# EAGLE design LayerOne_2011_bkt_switches (EAGLE 5.11)
OC_NEWARK: unknown
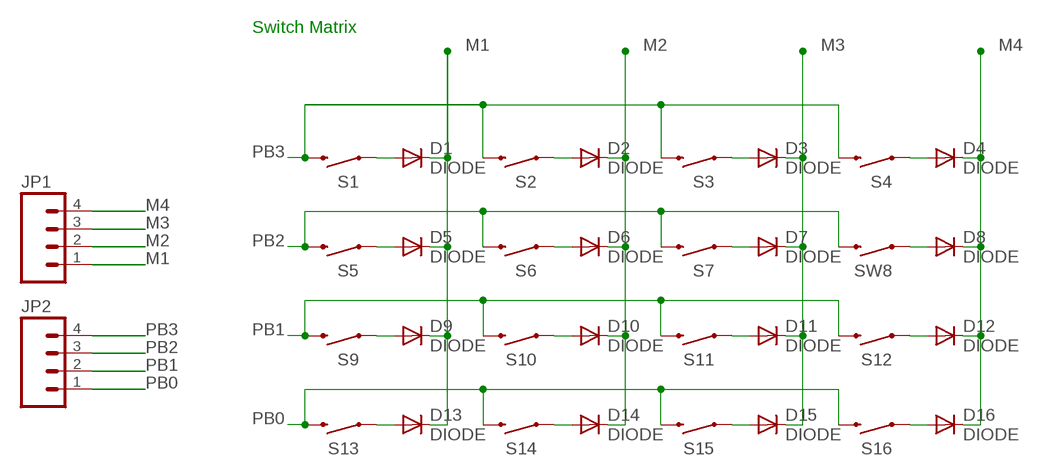
[diagram p0: schematic, sheet 1]

## Parts
D1  DIODE  DIODE1N4148  [DIODE-1N4148]
D2  DIODE  DIODE1N4148  [DIODE-1N4148]
D3  DIODE  DIODE1N4148  [DIODE-1N4148]
D4  DIODE  DIODE1N4148  [DIODE-1N4148]
D5  DIODE  DIODE1N4148  [DIODE-1N4148]
D6  DIODE  DIODE1N4148  [DIODE-1N4148]
D7  DIODE  DIODE1N4148  [DIODE-1N4148]
D8  DIODE  DIODE1N4148  [DIODE-1N4148]
D9  DIODE  DIODE1N4148  [DIODE-1N4148]
D10  DIODE  DIODE1N4148  [DIODE-1N4148]
D11  DIODE  DIODE1N4148  [DIODE-1N4148]
D12  DIODE  DIODE1N4148  [DIODE-1N4148]
D13  DIODE  DIODE1N4148  [DIODE-1N4148]
D14  DIODE  DIODE1N4148  [DIODE-1N4148]
D15  DIODE  DIODE1N4148  [DIODE-1N4148]
D16  DIODE  DIODE1N4148  [DIODE-1N4148]
JP1  M04PTH  [1X04]
JP2  M04PTH  [1X04]
S1  SWITCH-MOMENTARY-2PTH  [TACTILE-PTH]
S2  SWITCH-MOMENTARY-2PTH  [TACTILE-PTH]
S3  SWITCH-MOMENTARY-2PTH  [TACTILE-PTH]
S4  SWITCH-MOMENTARY-2PTH  [TACTILE-PTH]
S5  SWITCH-MOMENTARY-2PTH  [TACTILE-PTH]
S6  SWITCH-MOMENTARY-2PTH  [TACTILE-PTH]
S7  SWITCH-MOMENTARY-2PTH  [TACTILE-PTH]
S9  SWITCH-MOMENTARY-2PTH  [TACTILE-PTH]
S10  SWITCH-MOMENTARY-2PTH  [TACTILE-PTH]
S11  SWITCH-MOMENTARY-2PTH  [TACTILE-PTH]
S12  SWITCH-MOMENTARY-2PTH  [TACTILE-PTH]
S13  SWITCH-MOMENTARY-2PTH  [TACTILE-PTH]
S14  SWITCH-MOMENTARY-2PTH  [TACTILE-PTH]
S15  SWITCH-MOMENTARY-2PTH  [TACTILE-PTH]
S16  SWITCH-MOMENTARY-2PTH  [TACTILE-PTH]
SW8  SWITCH-MOMENTARY-2PTH  [TACTILE-PTH]

## Nets
M1: D1.C D5.C D9.C D13.C JP1.1
M2: D2.C D6.C D10.C D14.C JP1.2
M3: D3.C D7.C D11.C D15.C JP1.3
M4: D4.C D8.C D12.C D16.C JP1.4
N$13: D1.A S1.1
N$16: D2.A S2.1
N$17: D3.A S3.1
N$18: D4.A S4.1
N$19: D5.A S5.1
N$20: D6.A S6.1
N$21: D7.A S7.1
N$22: D8.A SW8.1
N$23: D9.A S9.1
N$24: D10.A S10.1
N$25: D11.A S11.1
N$26: D12.A S12.1
N$33: D13.A S13.1
N$34: D14.A S14.1
N$35: D15.A S15.1
N$36: D16.A S16.1
PB0: JP2.1 S13.3 S14.3 S15.3 S16.3
PB1: JP2.2 S9.3 S10.3 S11.3 S12.3
PB2: JP2.3 S5.3 S6.3 S7.3 SW8.3
PB3: JP2.4 S1.3 S2.3 S3.3 S4.3

## Notes on the sheet
- Switch Matrix

## Library data of the parts
D1-D16 = SparkFun:DIODE: Diode These are standard reverse protection diodes and small signal diodes. SMA package can handle up to about 1A. SOD-323 can handle about 200mA. What the SOD-323 package when ordering, there are some mfgs out there that are 5-pin packages.
JP1 JP2 = SparkFun:M04: Header 4 Standard 4-pin 0.1" header. Use with straight break away headers (SKU : PRT-00116), right angle break away headers (PRT-00553), swiss pins (PRT-00743), machine pins (PRT-00117), and female headers (PRT-00115). Molex polarized connector foot print use with SKU : PRT-08231 with associated crimp pins and housings. 1MM SMD Version SKU: PRT-10208
S1-S7 S9-S16 SW8 = LayerOne_2011:SWITCH-MOMENTARY-2

## Net classes
0 default: width 0.406 mm
1 LED: width 0.305 mm

## Board
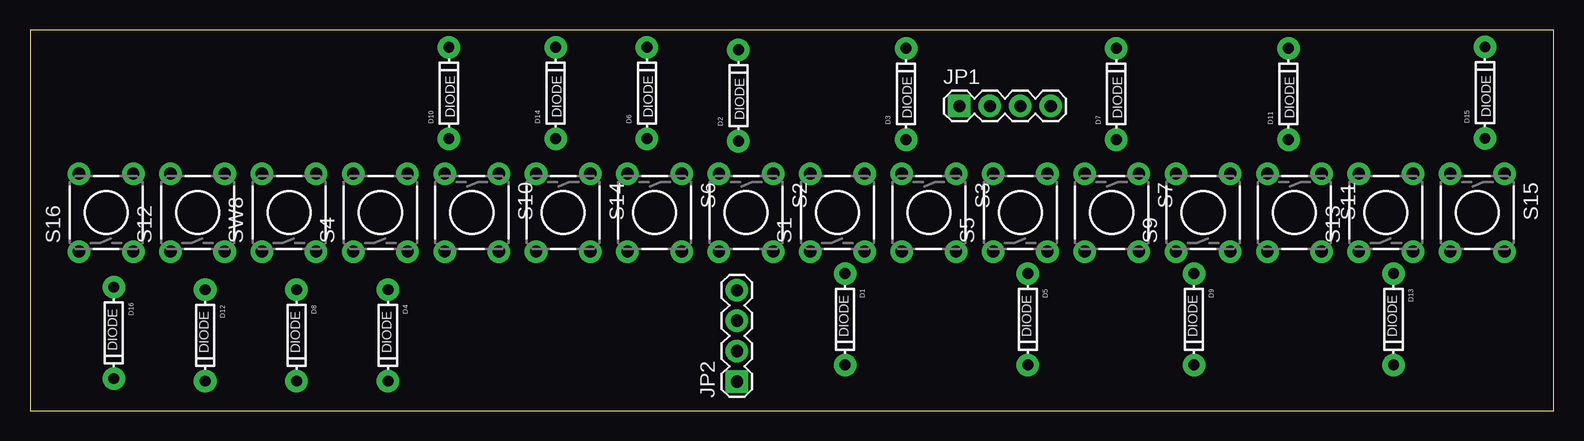
[diagram p1: board, top side]
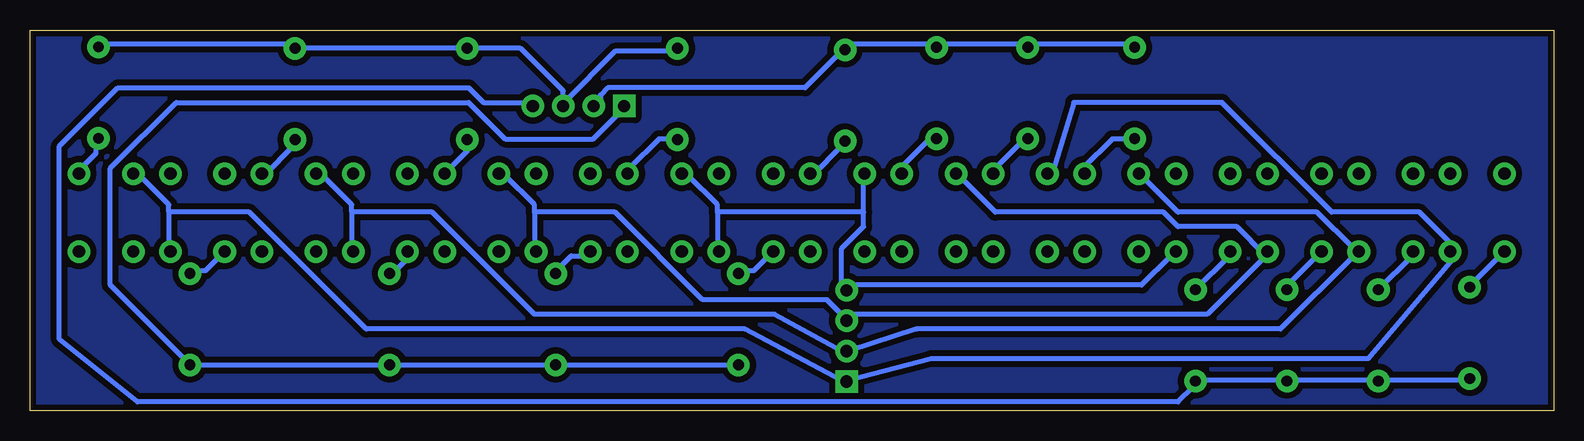
[diagram p2: board, bottom side, seen from below]

Size 127 x 31.75 mm. Coordinates in mm from the lower left corner, seen from the top.
Outline: 127,0 127,31.75 0,31.75 0,0 127,0
Copper layers (1*16): Top 0.0356mm / dielectric 1.5011mm / Bottom 0.0356mm
Design rules "SparkFun-mod *": minimum track width 8mil, minimum drill 32mil, track to track 14mil, track to pad 14mil, pad to pad 12mil, via to via 12mil, smd to smd 8mil, copper to edge 12mil, drill to drill 8mil, minimum pad ring 14mil, minimum via ring 10mil, stop-mask expansion 4mil, vias tented up to drill 34mil, thermal gap 10mil
Milling: 4 lines

### Footprints (pad centres in the part's own frame; a part is rotated, then mirrored left to right if it is on the bottom)
DIODE-1N4148 = drill 0.9 pad 1.88 round: A -3.81,0; C 3.81,0
1X04 = drill 1.016 pad 1.88 square: 1 0,0 | drill 1.016 pad 1.88 round: 2 2.54,0; 3 5.08,0; 4 7.62,0
TACTILE-PTH = drill 1.016 pad 1.88 round: 1 -3.251,2.261; 2 3.251,2.261; 3 -3.251,-2.261; 4 3.251,-2.261

### Placement (x,y rotation side)
D1  67.94,7.62 270 top
D2  59.05,26.29 90 top
D3  73.03,26.42 90 top
D4  29.84,6.27 270 top
D5  83.19,7.62 270 top
D6  51.44,26.49 90 top
D7  90.55,26.42 90 top
D8  22.23,6.27 270 top
D9  97.03,7.62 270 top
D10  34.92,26.49 90 top
D11  104.9,26.42 90 top
D12  14.61,6.27 270 top
D13  113.66,7.62 270 top
D14  43.81,26.49 90 top
D15  121.28,26.52 90 top
D16  6.98,6.48 270 top
JP1  77.47,25.4 0 top
JP2  58.93,2.41 90 top
S1  67.31,16.51 90 top
S2  59.69,16.51 270 top
S3  74.93,16.51 270 top
S4  29.21,16.51 90 top
S5  82.55,16.51 90 top
S6  52.07,16.51 270 top
S7  90.17,16.51 270 top
S9  97.79,16.51 90 top
S10  36.83,16.51 270 top
S11  105.41,16.51 270 top
S12  13.97,16.51 90 top
S13  113.03,16.51 90 top
S14  44.45,16.51 270 top
S15  120.65,16.51 270 top
S16  6.35,16.51 90 top
SW8  21.59,16.51 90 top

### Tracks (layer width: path | path; a pad name or v marks a point on that pad's centre or on a via)
M1
  Bottom 0.406: D1.C 68.48,3.76 83.11,3.76 D5.C 83.72,3.76 96.52,3.76 D9.C 97.13,3.76 113.59,3.76 D13.C 114.2,4.37 120.29,10.46 120.29,20.22 114.81,25.71 90.42,25.71 87.38,22.66 80.06,22.66 77.62,25.1 JP1.1
M2
  Bottom 0.406: D10.C 34.95,30.58 43.48,30.58 D14.C 44.09,30.58 51.41,30.58 D6.C 52.02,30.58 58.73,30.58 D2.C 59.33,29.97 62.38,26.92 78.84,26.92 79.45,26.31 79.45,25.71 JP1.2
M3
  Bottom 0.406: D3.C 73.35,29.97 78.23,29.97 82.5,25.71 JP1.3 82.55,26.67 86.11,30.23 D7.C 104.09,30.23 104.44,30.58 D11.C 105.05,30.58 120.9,30.58 D15.C
M4
  Bottom 0.406: D16.C 7.52,2.54 14.22,2.54 D12.C 14.83,2.54 22.15,2.54 D8.C 22.76,2.54 29.46,2.54 D4.C 30.07,1.93 31.29,0.71 118.06,0.71 124.56,5.94 124.56,22.05 119.69,26.92 90.42,26.92 89.21,25.71 85.55,25.71 JP1.4
N$1
  pour Bottom (isolate 0.508): 0,31.75 0,0 127,0 127,31.75
N$13
  Bottom 0.406: D1.A 67.87,11.68 66.65,11.68 65.43,12.9 S1.1
N$16
  Bottom 0.406: D2.A 59.33,22.05 61.77,19.61 S2.1
N$17
  Bottom 0.406: S3.1 77.01,20.22 74.57,22.66 73.35,22.66 D3.A
N$18
  Bottom 0.406: D4.A 27.03,12.9 S4.1
N$19
  Bottom 0.406: S5.1 80.67,12.9 81.89,12.9 83.11,11.68 D5.A
N$20
  Bottom 0.406: D6.A 52.02,22.66 54.46,20.22 S6.1
N$21
  Bottom 0.406: 92.25,19.61 S7.1 90.55,21.64 D7.A
N$22
  Bottom 0.406: D8.A 22.15,10.46 19.71,12.9 SW8.1
N$23
  Bottom 0.406: D9.A 96.52,11.68 95.3,12.9 S9.1
N$24
  Bottom 0.406: D10.A 34.95,22.66 36.78,22.66 39.22,20.22 S10.1
N$25
  Bottom 0.406: D11.A 105.05,22.05 107.49,19.61 S11.1
N$26
  Bottom 0.406: S12.1 11.79,12.9 D12.A
N$33
  Bottom 0.406: D13.A 113.59,11.68 112.37,11.68 111.15,12.9 S13.1
N$34
  Bottom 0.406: D14.A 44.09,22.66 46.53,20.22 S14.1
N$35
  Bottom 0.406: D15.A 121.51,22.66 121.51,21.44 122.73,20.22 S15.1
N$36
  Bottom 0.406: D16.A 6.91,10.46 4.47,12.9 S16.1
PB0
  Bottom 0.406: 115.42,16.56 115.42,17.17 117.86,19.61 S15.3 | 115.42,16.56 115.42,13.51 S13.3 | S14.3 41.66,20.22 39.98,25.71 27.64,25.71 18.49,16.56 11.18,16.56 8.13,13.51 S16.3 8.13,12.9 15.44,4.32 51.87,4.32 58.73,2.54 JP2.1 59.33,2.54 67.41,6.81 98.96,6.81 108.71,16.56 115.42,16.56
PB1
  Bottom 0.406: 100.18,16.56 100.18,17.17 102.62,19.61 S11.3 | 100.18,16.56 100.18,13.51 S9.3 | S10.3 34.34,19.61 31.29,16.56 19.71,16.56 16.66,13.51 S12.3 16.66,12.9 22.76,6.81 53.09,6.81 58.73,4.98 JP2.2 59.33,4.98 64.92,8.03 84.94,8.03 93.47,16.56 100.18,16.56
PB2
  Bottom 0.406: 84.94,16.56 84.94,17.17 87.38,19.61 S7.3 | 84.94,16.56 84.94,13.51 S5.3 | 23.98,12.9 28.85,8.03 58.73,8.03 JP2.3 59.33,8.03 60.55,9.25 70.92,9.25 78.23,16.56 84.94,16.56 | 23.98,12.9 26.42,15.34 31.29,15.34 32.51,16.56 46.53,16.56 49.58,19.61 S6.3 | SW8.3 23.98,12.9
PB3
  Bottom 0.406: 69.7,16.56 69.7,17.17 72.14,19.61 S3.3 | 69.7,16.56 69.7,13.51 S1.3 | S4.3 31.9,12.9 34.34,10.46 58.73,10.46 JP2.4 59.33,10.46 59.33,13.51 57.51,15.34 57.51,16.56 | 57.51,16.56 57.51,19.61 S2.3 | 57.51,16.56 69.7,16.56

### Text on the board
_tsilk: LayerOne | protoype